# EAGLE schematic sensor (EAGLE 7.2.0)
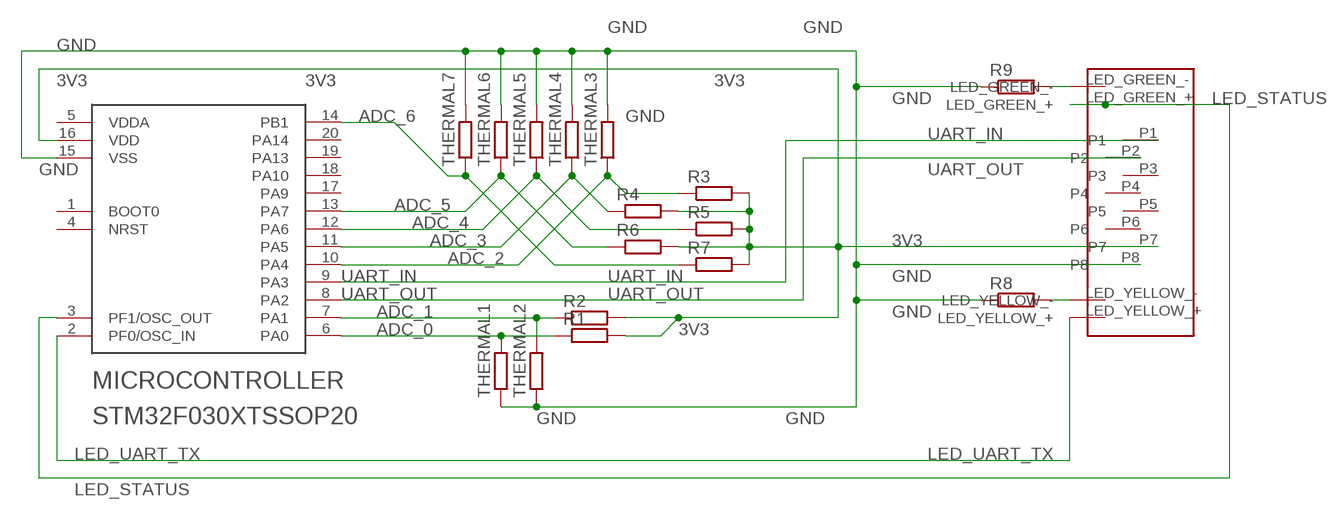
[diagram p0: schematic, sheet 1]

## Parts
MICROCONTROLLER  STM32F030XTSSOP20  [TSSOP-20]
R1  R-EU_0204/5  [0204/5]
R2  R-EU_0204/5  [0204/5]
R3  R-EU_0204/5  [0204/5]
R4  R-EU_0204/5  [0204/5]
R5  R-EU_0204/5  [0204/5]
R6  R-EU_0204/5  [0204/5]
R7  R-EU_0204/5  [0204/5]
R8  R-EU_0204/5  [0204/5]
R9  R-EU_0204/5  [0204/5]
THERMAL1  R-EU_V526-0  [V526-0]
THERMAL2  R-EU_V526-0  [V526-0]
THERMAL3  R-EU_V526-0  [V526-0]
THERMAL4  R-EU_V526-0  [V526-0]
THERMAL5  R-EU_V526-0  [V526-0]
THERMAL6  R-EU_V526-0  [V526-0]
THERMAL7  R-EU_V526-0  [V526-0]
U$1  RJHSE-5481_(RJ45)  [RJHSE-5481_(RJ45)]

## Nets
3V3: MICROCONTROLLER.16(VDD) R1.2 R2.2 R3.2 R4.2 R5.2 R6.2 R7.2 U$1.P7
ADC_0: MICROCONTROLLER.6(PA0) R1.1 THERMAL1.2
ADC_1: MICROCONTROLLER.7(PA1) R2.1 THERMAL2.2
ADC_2: MICROCONTROLLER.10(PA4) R3.1 THERMAL3.1
ADC_3: MICROCONTROLLER.11(PA5) R4.1 THERMAL4.1
ADC_4: MICROCONTROLLER.12(PA6) R5.1 THERMAL5.1
ADC_5: MICROCONTROLLER.13(PA7) R6.1 THERMAL6.1
ADC_6: MICROCONTROLLER.14(PB1) R7.1 THERMAL7.1
GND: MICROCONTROLLER.15(VSS) R8.1 R9.1 THERMAL1.1 THERMAL2.1 THERMAL3.2 THERMAL4.2 THERMAL5.2 THERMAL6.2 THERMAL7.2 U$1.P8
LED_STATUS: MICROCONTROLLER.3(PF1/OSC_OUT) U$1.LED_GREEN_+
LED_UART_TX: MICROCONTROLLER.2(PF0/OSC_IN)
N$1: R9.2
N$2: R8.2
UART_IN: MICROCONTROLLER.9(PA3) U$1.P1
UART_OUT: MICROCONTROLLER.8(PA2) U$1.P2
Unconnected: MICROCONTROLLER.1(BOOT0) MICROCONTROLLER.4(NRST) MICROCONTROLLER.5(VDDA) MICROCONTROLLER.17(PA9) MICROCONTROLLER.18(PA10) MICROCONTROLLER.19(PA13) MICROCONTROLLER.20(PA14) U$1.LED_GREEN_- U$1.LED_YELLOW_+ U$1.LED_YELLOW_- U$1.P3 U$1.P4 U$1.P5 U$1.P6

## Library data of the parts
MICROCONTROLLER = stm32f030x:STM32F030X
R1-R9 THERMAL1-THERMAL7 = resistor:R-EU_: RESISTOR, European symbol
U$1 = ut-connectors:RJHSE-5481_(RJ45)